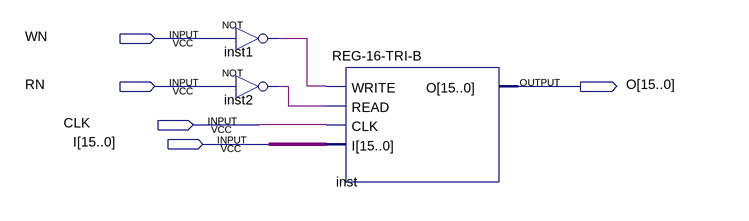
[diagram p0: schematic sheet]
// Quartus schematic REG16-TRI-B-N.bdf as structural Verilog: 3 symbols, 5 pins
module \REG16-TRI-B-N  (
  input  WN,
  input  RN,
  input  CLK,
  input  [15:0] I,
  output [15:0] O
);

  wire inst1_out, inst2_out;

  not inst1 (inst1_out, WN);
  not inst2 (inst2_out, RN);
  \REG-16-TRI-B  inst (.WRITE(inst1_out), .READ(inst2_out), .CLK(CLK), .I(I), .O(O));
endmodule
